# Altium project hand_fpc_v1.PrjPcb
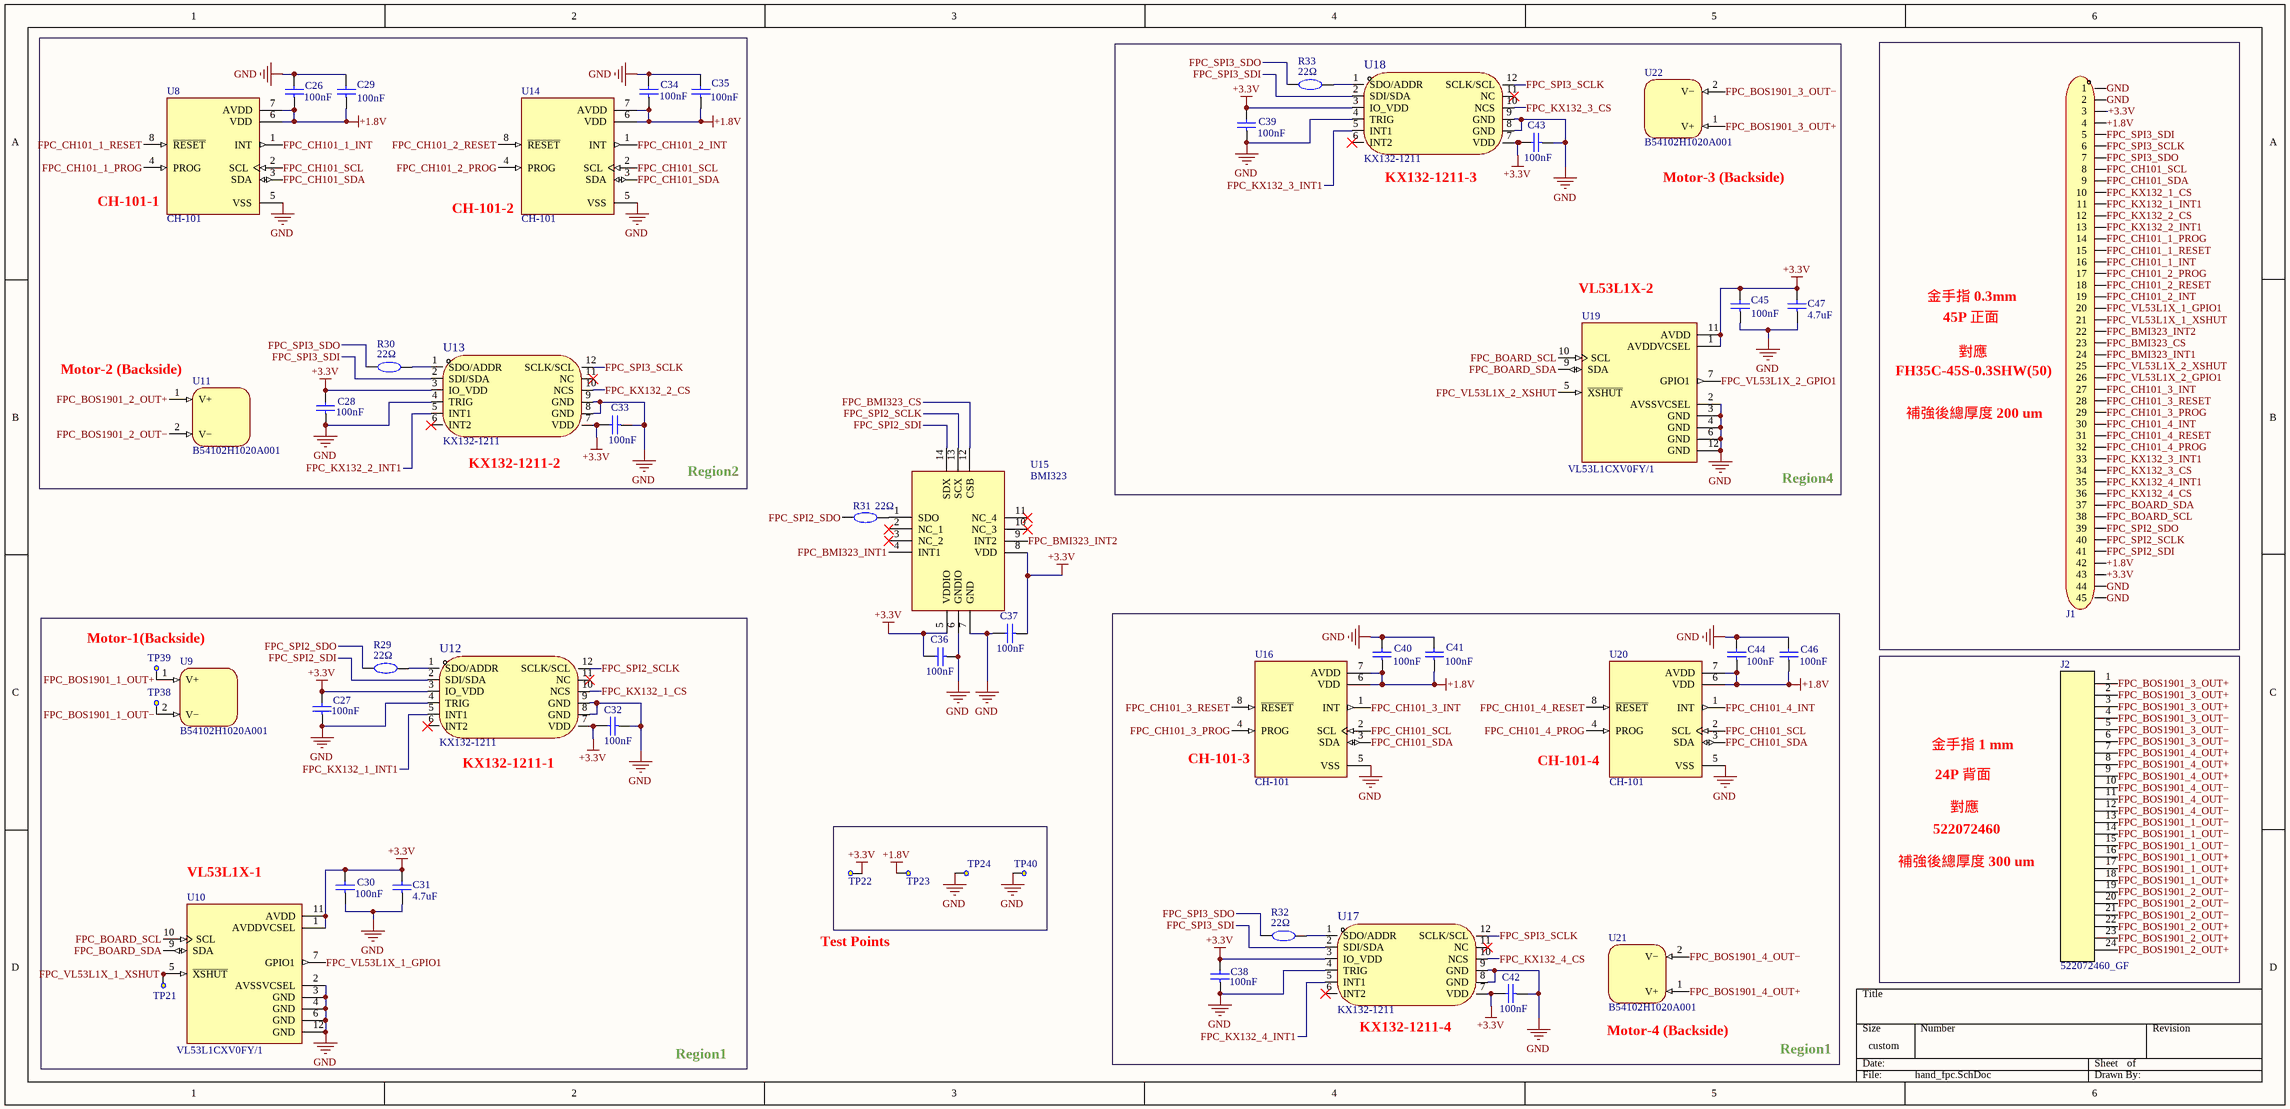
[diagram p0: hand_fpc.SchDoc]
1 sheet, 51 parts. Net scope: global (net labels, ports and power ports of the same name join across sheets).
Board file: hand_fpc.PcbDoc

## Sheet hand_fpc.SchDoc
size 500 x 241 mm; SheetNumber: 1; SheetTotal: 1

### Parts
C26  100nF  [C1206_FPC]
C27  100nF  [C1206_FPC]
C28  100nF  [C1206_FPC]
C29  100nF  [C1206_FPC]
C30  100nF  [C1206_FPC]
C31  4.7uF  [C1206_FPC]
C32  100nF  [C1206_FPC]
C33  100nF  [C1206_FPC]
C34  100nF  [C1206_FPC]
C35  100nF  [C1206_FPC]
C36  100nF  [C1206_FPC]
C37  100nF  [C1206_FPC]
C38  100nF  [C1206_FPC]
C39  100nF  [C1206_FPC]
C40  100nF  [C1206_FPC]
C41  100nF  [C1206_FPC]
C42  100nF  [C1206_FPC]
C43  100nF  [C1206_FPC]
C44  100nF  [C1206_FPC]
C45  100nF  [C1206_FPC]
C46  100nF  [C1206_FPC]
C47  4.7uF  [C1206_FPC]
J1  FH35C-45S-0.3SHW-GF  [FH35C-45S-0.3SHW-GF-REVERSE]  (value not drawn)
J2  522072460_GF  [522072460-GF-Back]
R29  22Ω  [R1206_FPC]
R30  22Ω  [R1206_FPC]
R31  22Ω  [R1206_FPC]
R32  22Ω  [R1206_FPC]
R33  22Ω  [R1206_FPC]
TP21  Test point  [Test_Point_FPC]  (value not drawn)
TP22  Test point  [Test_Point_FPC]  (value not drawn)
TP23  Test point  [Test_Point_FPC]  (value not drawn)
TP24  Test point  [Test_Point_FPC]  (value not drawn)
TP38  Test point  [Test_Point_FPC]  (value not drawn)
TP39  Test point  [Test_Point_FPC]  (value not drawn)
TP40  Test point  [Test_Point_FPC]  (value not drawn)
U8  CH-101  [XDCR_CH-101]
U9  B54102H1020A001  [B54102H1020A001]
U10  VL53L1CXV0FY/1  [SENSOR_VL53L1CXV0FY/1]
U11  B54102H1020A001  [B54102H1020A001]
U12  KX132-1211  [LGA-12_L2.0-W2.0-P0.50-TL]
U13  KX132-1211  [LGA-12_L2.0-W2.0-P0.50-TL]
U14  CH-101  [XDCR_CH-101]
U15  BMI323  [BMI323]
U16  CH-101  [XDCR_CH-101]
U17  KX132-1211  [LGA-12_L2.0-W2.0-P0.50-TL]
U18  KX132-1211  [LGA-12_L2.0-W2.0-P0.50-TL]
U19  VL53L1CXV0FY/1  [SENSOR_VL53L1CXV0FY/1]
U20  CH-101  [XDCR_CH-101]
U21  B54102H1020A001  [B54102H1020A001]
U22  B54102H1020A001  [B54102H1020A001]

### Nets
+1.8V: C26.1 C29.1 C34.1 C35.1 C40.1 C41.1 C44.1 C46.1 J1.4 J1.42 TP23.TP?(Test_point) U8.6(VDD) U8.7(AVDD) U14.6(VDD) U14.7(AVDD) U16.6(VDD) U16.7(AVDD) U20.6(VDD) U20.7(AVDD)
+3.3V: C27.2 C28.2 C30.2 C31.2 C32.2 C33.2 C36.2 C37.1 C38.2 C39.2 C42.2 C43.2 C45.2 C47.2 J1.3 J1.43 TP22.TP?(Test_point) U10.1(AVDDVCSEL) U10.11(AVDD) U12.3(IO_VDD) U12.7(VDD) U13.3(IO_VDD) U13.7(VDD) U15.5(VDDIO) U15.8(VDD) U17.3(IO_VDD) U17.7(VDD) U18.3(IO_VDD) U18.7(VDD) U19.1(AVDDVCSEL) U19.11(AVDD)
GND: C26.2 C27.1 C28.1 C29.2 C30.1 C31.1 C32.1 C33.1 C34.2 C35.2 C36.1 C37.2 C38.1 C39.1 C40.2 C41.2 C42.1 C43.1 C44.2 C45.1 C46.2 C47.1 J1.1 J1.2 J1.44 J1.45 TP24.TP?(Test_point) TP40.TP?(Test_point) U8.5(VSS) U10.2(AVSSVCSEL) U10.3(GND) U10.4(GND) U10.6(GND) U10.12(GND) U12.4(TRIG) U12.8(GND) U12.9(GND) U13.4(TRIG) U13.8(GND) U13.9(GND) U14.5(VSS) U15.6(GNDIO) U15.7(GND) U16.5(VSS) U17.4(TRIG) U17.8(GND) U17.9(GND) U18.4(TRIG) U18.8(GND) U18.9(GND) U19.2(AVSSVCSEL) U19.3(GND) U19.4(GND) U19.6(GND) U19.12(GND) U20.5(VSS)
FPC_BMI323_CS: J1.23 U15.12(CSB)
FPC_BMI323_INT1: J1.24 U15.4(INT1)
FPC_BMI323_INT2: J1.22 U15.9(INT2)
FPC_BOARD_SCL: J1.38 U10.10(SCL) U19.10(SCL)
FPC_BOARD_SDA: J1.37 U10.9(SDA) U19.9(SDA)
FPC_BOS1901_1_OUT+: J2.16 J2.17 J2.18 TP39.TP?(Test_point) U9.1(V+)
FPC_BOS1901_1_OUT−: J2.13 J2.14 J2.15 TP38.TP?(Test_point) U9.2(V−)
FPC_BOS1901_2_OUT+: J2.22 J2.23 J2.24 U11.1(V+)
FPC_BOS1901_2_OUT−: J2.19 J2.20 J2.21 U11.2(V−)
FPC_BOS1901_3_OUT+: J2.1 J2.2 J2.3 U22.1(V+)
FPC_BOS1901_3_OUT−: J2.4 J2.5 J2.6 U22.2(V−)
FPC_BOS1901_4_OUT+: J2.7 J2.8 J2.9 U21.1(V+)
FPC_BOS1901_4_OUT−: J2.10 J2.11 J2.12 U21.2(V−)
FPC_CH101_1_INT: J1.16 U8.1(INT)
FPC_CH101_1_PROG: J1.14 U8.4(PROG)
FPC_CH101_1_RESET: J1.15 U8.8(~{RESET})
FPC_CH101_2_INT: J1.19 U14.1(INT)
FPC_CH101_2_PROG: J1.17 U14.4(PROG)
FPC_CH101_2_RESET: J1.18 U14.8(~{RESET})
FPC_CH101_3_INT: J1.27 U16.1(INT)
FPC_CH101_3_PROG: J1.29 U16.4(PROG)
FPC_CH101_3_RESET: J1.28 U16.8(~{RESET})
FPC_CH101_4_INT: J1.30 U20.1(INT)
FPC_CH101_4_PROG: J1.32 U20.4(PROG)
FPC_CH101_4_RESET: J1.31 U20.8(~{RESET})
FPC_CH101_SCL: J1.8 U8.2(SCL) U14.2(SCL) U16.2(SCL) U20.2(SCL)
FPC_CH101_SDA: J1.9 U8.3(SDA) U14.3(SDA) U16.3(SDA) U20.3(SDA)
FPC_KX132_1_CS: J1.10 U12.10(NCS)
FPC_KX132_1_INT1: J1.11 U12.5(INT1)
FPC_KX132_2_CS: J1.12 U13.10(NCS)
FPC_KX132_2_INT1: J1.13 U13.5(INT1)
FPC_KX132_3_CS: J1.34 U18.10(NCS)
FPC_KX132_3_INT1: J1.33 U18.5(INT1)
FPC_KX132_4_CS: J1.36 U17.10(NCS)
FPC_KX132_4_INT1: J1.35 U17.5(INT1)
FPC_SPI2_SCLK: J1.40 U12.12(SCLK/SCL) U15.13(SCX)
FPC_SPI2_SDI: J1.41 U12.2(SDI/SDA) U15.14(SDX)
FPC_SPI2_SDO: J1.39 R29.1 R31.1
FPC_SPI3_SCLK: J1.6 U13.12(SCLK/SCL) U17.12(SCLK/SCL) U18.12(SCLK/SCL)
FPC_SPI3_SDI: J1.5 U13.2(SDI/SDA) U17.2(SDI/SDA) U18.2(SDI/SDA)
FPC_SPI3_SDO: J1.7 R30.1 R32.1 R33.1
FPC_VL53L1X_1_GPIO1: J1.20 U10.7(GPIO1)
FPC_VL53L1X_1_XSHUT: J1.21 TP21.TP?(Test_point) U10.5(~{XSHUT})
FPC_VL53L1X_2_GPIO1: J1.26 U19.7(GPIO1)
FPC_VL53L1X_2_XSHUT: J1.25 U19.5(~{XSHUT})
NetR29_2: R29.2 U12.1(SDO/ADDR)
NetR30_2: R30.2 U13.1(SDO/ADDR)
NetR31_2: R31.2 U15.1(SDO)
NetR32_2: R32.2 U17.1(SDO/ADDR)
NetR33_2: R33.2 U18.1(SDO/ADDR)

Not connected (* = marked no-connect by the designer): U12 6(INT2)* 11(NC)*; U13 6(INT2)* 11(NC)*; U15 2(NC_1)* 3(NC_2)* 10(NC_3)* 11(NC_4)*; U17 6(INT2)* 11(NC)*; U18 6(INT2)* 11(NC)*

### Notes on the sheet
- (near U18) KX132-1211-3
- (near U22) Motor-3 (Backside)
- (near U8) CH-101-1
- (near U14) CH-101-2
- (near U19) VL53L1X-2
- 金手指 0.3mm
- (near U11) Motor-2 (Backside)
- FH35C-45S-0.3SHW(50)
- 45P 正面
- 對應
- 補強後總厚度 200 um
- (near U13) KX132-1211-2
- Region2
- Region4
- Motor-1(Backside)
- (near U12) KX132-1211-1
- (near U16) CH-101-3
- (near U20) CH-101-4
- 金手指 1 mm
- 24P 背面
- 522072460
- (near U10) VL53L1X-1
- 補強後總厚度 300 um
- Test Points
- Region1
- (near U17) KX132-1211-4
- (near U21) Motor-4 (Backside)

### Library data of the parts
C26-C30 C32-C46 = CL31B104KBCNNNC: MLCC, 100 nF, 50 V, ± 10%, X7R, 1206; Manufacturer: SAMSUNG(三星); Add into BOM: yes; Voltage Rated: 50V; Symbol: CL31B104KBCNNNC; Device: CL31B104KBCNNNC; Supplier: LCSC; Manufacturer Part: CL31B104KBCNNNC; Value: 100nF; Supplier Part: C24497; JLCPCB Part Class: 基础库; LCSC Part Name: 100nF ±10% 50V; Supplier Footprint: 1206; Datasheet: https://atta.szlcsc.com/upload/public/pdf/source/20160218/1457707763339.pdf; Convert to PCB: yes; Tolerance: ±10%; Temperature Coefficient: X7R; Name: 100nF
C31 C47 = 1206B475K500NT: MLCC, 4.7 uF, 50 V, ± 10%, X7R, 1206; Manufacturer: FH(风华); Add into BOM: yes; Voltage Rated: 50V; Tolerance: ±10%; Name: 4.7uF; Symbol: 1206B475K500NT; Device: 1206B475K500NT; Supplier: LCSC; Manufacturer Part: 1206B475K500NT; Value: 4.7uF; Supplier Part: C29823; JLCPCB Part Class: 基础库; LCSC Part Name: 4.7uF ±10% 50V; Supplier Footprint: 1206; Datasheet: https://atta.szlcsc.com/upload/public/pdf/source/20200305/C486355_26A10D38EF8C2A5C37091D0039909270.pdf; Convert to PCB: yes; Temperature Coefficient: X7R
J1 = FH35C-45S-0.3SHW-GF: Golden Finger Footprint of FH35C-45S-0.3SHW, 45 Pins, 0.3mm cross, up contact
J2 = 522072460_GF: FFC 1mm 24P Golden Finger; Mfr_Name: Molex Connector Corporation; RefDes: RefDes; Type: Type
R29-R33 = 1206W4F220JT5E: Resistor, Res Thick Film 1206 22 Ohm 1% 0.25W(1/4W) ±100ppm/°C Pad SMD T/R 200 V; Manufacturer: UNI-ROYAL(厚声); Add into BOM: yes; Power(Watts): 250mW; Overload Voltage (Max): 200V; Temperature Coefficient: ±100ppm/℃; Symbol: 1206W4F220JT5E; Device: 1206W4F220JT5E; Supplier: LCSC; Manufacturer Part: 1206W4F220JT5E; Supplier Part: C17958; Value: 22Ω; JLCPCB Part Class: 基础库; LCSC Part Name: 22Ω ±1% 250mW 厚膜电阻; Supplier Footprint: 1206; Datasheet: https://atta.szlcsc.com/upload/public/pdf/source/20200306/C422600_1E6D84923E4A46A82E41ADD87F860B5C.pdf; Convert to PCB: yes; Type: 厚膜电阻; Tolerance: ±1%; Operating Temperature Range: -55℃~+155℃; Name: 22Ω
TP21-TP24 TP38-TP40 = Test_Point: Value: Test point
U8 U14 U16 U20 = CH-101: Ultrasonic MEMS based Time-of-Flight _ToF_ Range Sensor; MF: TDK InvenSense; MP: CH-101; Value: *; Availability: Unavailable; Package: SOT-23-6 TDK InvenSense; SnapEDA_Link: https://www.snapeda.com/parts/CH-101/TDK%20InvenSense/view-part/4477814/?ref=snap; Price: None
U9 U11 U21 U22 = B54102H1020A001: TDK PowerHap™, Piezo Haptic Actuator Metal Sealed 15N 65um 32KHz Bulk; Manufacturer: TDK EPCOS; Voltage Rating: 120V; Category: Motors and Drives; Manufacturer Part Number: B54102H1020A001; Max Operating Temperature: 85°C; Min Operating Temperature: -40°C; Series: PowerHap™; Termination: Solder; Name: B54102H1020A001
U10 U19 = VL53L1CXV0FY/1: Optical Sensor 157.480 (4m) I2C Output; MF: STMicroelectronics; SnapEDA_Link: https://www.snapeda.com/parts/VL53L1CXV0FY/1/STMicroelectronics/view-part/?ref=snap; Package: LGA-12 STMicroelectronics; MP: VL53L1CXV0FY/1; Check_prices: https://www.snapeda.com/parts/VL53L1CXV0FY/1/STMicroelectronics/view-part/?ref=eda; Purchase-URL: https://pricing.snapeda.com/search/part/VL53L1CXV0FY/1/?ref=eda; Price: None; Value: *; Availability: In Stock
U12 U13 U17 U18 = KX132-1211: KX132 Series 3.6 V ±2g/4g/8g/16g SMT 3 Axis Digital Accelerometer- LGA-12; Manufacturer: ROHM(罗姆); Add into BOM: yes; Symbol: KX132-1211; Device: KX132-1211; Supplier: LCSC; Supplier Part: C2157931; Manufacturer Part: KX132-1211; JLCPCB Part Class: Extended Part; LCSC Part Name: KX132-1211; Supplier Footprint: LGA-12(2x2); Datasheet: https://atta.szlcsc.com/upload/public/pdf/source/20210603/40873EBC715D8EC3E8B8B154E7D59925.pdf; Convert to PCB: yes; Name: KX132-1211
U15 = BMI323: BOSCH IMU IC; Datasheet Link: https://www.bosch-sensortec.com/media/boschsensortec/downloads/datasheets/bst-bmi323-ds000.pdf; Height: 0.87mm; Manufacturer_Name: BOSCH; Manufacturer_Part_Number: BMI323; Mouser Part Number: 262-BMI323; Mouser Price/Stock: https://www.mouser.co.uk/ProductDetail/Bosch-Sensortec/BMI323?qs=By6Nw2ByBD3%2FE1v0UqNQPQ%3D%3D; Arrow Part Number: BMI323; Arrow Price/Stock: https://www.arrow.com/en/products/bmi323/bosch?region=nac